# Altium project ELEC252_PowerSupply.PrjPcb
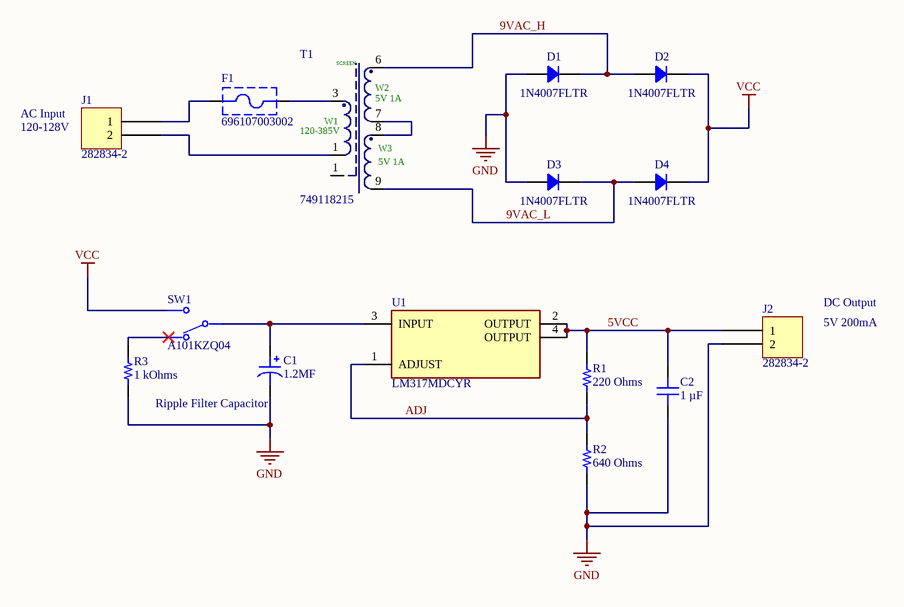
[diagram p0: TOP.SchDoc]
1 sheet, 15 parts. Net scope: global (net labels, ports and power ports of the same name join across sheets).

## Sheet TOP.SchDoc
size A; SheetNumber: 1; SheetTotal: 1

### Parts
C1  1.2MF  [CAP TH ALUM ELEC D18.00mm S7.50mm H21.50mm]
C2  1 µF  [CAP 0805_2012]
D1  1N4007FLTR  [SOD123F]
D2  1N4007FLTR  [SOD123F]
D3  1N4007FLTR  [SOD123F]
D4  1N4007FLTR  [SOD123F]
F1  696107003002  [696107003002]
J1  282834-2  [TE 282834-2]
J2  282834-2  [TE 282834-2]
R1  220 Ohms  [RES 0805_2012]
R2  640 Ohms  [RES 0805_2012]
R3  1 kOhms  [RES 0805_2012]
SW1  A101KZQ04  [FP-A101KZQ04-MFG]
T1  749118215  [EE16_8_5 (EF16)]
U1  LM317MDCYR  [FP-DCY0004A-MFG]

### Nets
GND: C1.2 C2.1 D1.1 D3.1 J2.2 R2.1 R3.2
VCC: D2.2 D4.2
5VCC: C2.2 J2.1 R1.2 U1.2(OUTPUT) U1.4(OUTPUT)
9VAC_H: D1.2 D2.1 T1.6
9VAC_L: D3.2 D4.1 T1.9
ADJ: R1.1 R2.2 U1.1(ADJUST)
NetC1_1: C1.1 U1.3(INPUT)
NetF1_1: F1.1 J1.1
NetF1_2: F1.2 T1.3
NetJ1_2: J1.2 T1.1
NetT1_7: T1.7 T1.8

Not connected (* = marked no-connect by the designer): R3 1*

### Notes on the sheet
- (near J1) AC Input
- (near J1) 120-128V
- DC Output
- 5V 200mA
- (near C1) Ripple Filter Capacitor
- (in symbol CMP-1476-00009-1) SCREEN; W2; 5V 1A; W1; 120-385V; W3

### Library data of the parts
C1 = EGQB350ELL122M20H: ALUMINUM CAPACITOR; manufacturer: United Chemi-Con; ESR (Equivalent Series Resistance): 84mOhm @ 100kHz; Lifetime @ Temp.: 1000 Hrs @ 150°C; Polarization: Polar; Ripple Current @ High Frequency: 3.25A @ 100kHz; Ripple Current @ Low Frequency: 1.95A @ 120Hz; Tolerance: ±20%; Voltage - Rated: 35V; Part Number: EGQB350ELL122M20H; Applications: Automotive; Capacitance: 1.2MF; componentlink1description: Datasheet; componentlink1url: http://www.chemi-con.co.jp/cgi-bin/CAT_DB/SEARCH/cat_db_al.cgi?e=e&j=p&pdfname=gqb; componentlink2description: DigiKey Link; componentlink2url: http://digikey.com/product-detail/en/united-chemi-con/EGQB350ELL122M20H/565-EGQB350ELL122M20H-ND/10486439; Device Package: Radial, Can; Height - Seated (Max): 0.846" (21.50mm); lastupdated: 9/2/2020 1:33:14 AM; Lead Spacing: 0.295" (7.50mm); Lifecycle Status: Active; Minimum Order: 1; Mounting Type: Through Hole; Operating Temperature: -40°C ~ 150°C; Package / Case: Radial, Can; packaging: Bulk; partid: 18006; Part Status: Active; price: 1.86; Ratings: AEC-Q200; series: GQB; Size / Dimension: 0.709" Dia (18.00mm); Supplier 1: DigiKey; Supplier Part Number 1: 565-EGQB350ELL122M20H-ND; value: 1.2MF
C2 = GMC21X5R105K50NT: CAP0805 X5R 1UF 10% 50V; manufacturer: Cal-Chip Electronics, Inc.; Part Number: GMC21X5R105K50NT; Value: 1 µF; Applications: General Purpose; Capacitance: 1 µF; componentlink1description: Datasheet; componentlink1url: https://88ce57.p3cdn1.secureserver.net/wp-content/uploads/2023/01/gmc_series-2.pdf; componentlink2description: DigiKey Link; componentlink2url: https://www.digikey.com/en/products/detail/cal-chip-electronics-inc/GMC21X5R105K50NT/19910722; Device Package: 0805 (2012 Metric); lastupdated: 2/4/2024 8:13:22 PM; Lifecycle Status: Active; Minimum Order: 1; Mounting Type: Surface Mount, MLCC; Operating Temperature: -55°C ~ 85°C; Package / Case: 0805 (2012 Metric); packaging: TapeAndReel; partid: 56638; price: 0.04; series: GMC; Size / Dimension: 0.079" L x 0.049" W (2.00mm x 1.25mm); Supplier 1: DigiKey; Supplier Part Number 1: 4713-GMC21X5R105K50NTCT-ND; Temperature Coefficient: X5R; Thickness (Max): 0.057" (1.45mm); Tolerance: ±10%; Voltage - Rated: 50V
D1-D4 = 1N4007FLTR: STANDARD RECTIFIER 1000V SOD-123; Manufacturer: SMC Diode Solutions; Capacitance @ Vr, F: 15pF @ 4V, 1MHz; Current - Average Rectified (Io): 1A; Current - Reverse Leakage @ Vr: 5µA @ 1000V; Speed: Standard Recovery >500ns, > 200mA (Io); Voltage - Forward (Vf) (Max) @ If: 1.1V @ 1A; Part Number: 1N4007FLTR; ComponentLink1Description: Datasheet; ComponentLink1URL: http://www.smc-diodes.com/propdf/1N4001FL-1N4007FL%20N1646%20REV.A.pdf; ComponentLink2Description: DigiKey Link; ComponentLink2URL: http://digikey.com/product-detail/en/smc-diode-solutions/1N4007FLTR/1655-1N4007FLCT-ND/11657827; Diode Type: Standard; LastUpdated: 8/30/2020 8:59:55 PM; Lifecycle Status: Active; Minimum Order: 1; Mounting Type: Surface Mount; Package / Case: SOD-123F; Packaging: TapeAndReel; PartId: 3314; Price: 0.01; Supplier 1: DigiKey; Supplier Part Number 1: 1655-1N4007FLCT-ND; Supplier Device Package: SOD-123FL; Voltage - DC Reverse (Vr) (Max): 1000V
F1 = CMP-1502-00236-2: NexarPartId: 56808806; Fuse Current: 10A; Voltage Rating (AC): 250V; Mount: Through Hole; RoHS: Non-Compliant; Packaging: Box; REACH SVHC: Unknown
J1 J2 = 282834-2: TERM BLK 2P SIDE ENT 2.54MM PCB; Manufacturer: TE Connectivity AMP Connectors; Current: 10A; Mating Orientation: Horizontal with Board; Number of Levels: 1; Pitch: 0.100" (2.54mm); Positions Per Level: 2; Voltage: 150V; Wire Gauge: 16-30 AWG; Wire Termination: Screw - Rising Cage Clamp; Part Number: 282834-2; Color: Green; ComponentLink1Description: Datasheet; ComponentLink1URL: https://www.te.com/commerce/DocumentDelivery/DDEController?Action=srchrtrv&DocNm=282834&DocType=Customer+Drawing&DocLang=English; ComponentLink2Description: DigiKey Link; ComponentLink2URL: http://digikey.com/product-detail/en/te-connectivity-amp-connectors/282834-2/A98333-ND/1150135; LastUpdated: 1/15/2020 4:15:38 AM; Lifecycle Status: Active; Minimum Order: 1; Mounting Type: Through Hole; Packaging: Bulk; Part Status: Active; Price: 0.88; Series: Buchanan; Supplier 1: DigiKey; Supplier Part Number 1: A98333-ND
R1 = ERJ-6GEYJ221V: RES SMD 220 OHM 5% 1/8W 0805; Manufacturer: Panasonic Electronic Components; Power (Watts): 0.125W, 1/8W; Temperature Coefficient: ±200ppm/°C; Part Number: ERJ-6GEYJ221V; Value: 220 Ohms; ComponentLink1Description: Datasheet; ComponentLink1URL: http://industrial.panasonic.com/www-cgi/jvcr13pz.cgi?E+PZ+3+AOA0001+ERJ6GEYJ221V+7+WW; ComponentLink2Description: DigiKey Link; ComponentLink2URL: https://www.digikey.com/en/products/detail/panasonic-electronic-components/ERJ-6GEYJ221V/89706; Composition: Thick Film; Device Package: 0805 (2012 Metric); Features: Automotive AEC-Q200; Height - Seated (Max): 0.028" (0.70mm); LastUpdated: 2/4/2024 9:05:03 PM; Lifecycle Status: Active; Minimum Order: 1; Number of Terminations: 2; Operating Temperature: -55°C ~ 155°C; Package / Case: 0805 (2012 Metric); Packaging: TapeAndReel; PartId: 30015; Part Status: Active; Price: 0.01; Ratings: AEC-Q200; Resistance: 220 Ohms; Series: ERJ-6G; Size / Dimension: 0.079" L x 0.049" W (2.00mm x 1.25mm); Supplier 1: DigiKey; Supplier Part Number 1: P220ACT-ND; Supplier Device Package: 0805; Tolerance: ±5%
R2 = APC0805B10K0N: CRCW0805640RFKTA; Manufacturer: Ohmite; Power (Watts): 0.1W, 1/10W; Resistance: 10 kOhms; Temperature Coefficient: ±25ppm/°C; Tolerance: ±0.1%; Part Number: APC0805B10K0N; Value: 640 Ohms; ComponentLink1Description: Datasheet; ComponentLink1URL: https://www.ohmite.com/assets/docs/APC-1-15.34.pdf; ComponentLink2Description: DigiKey Link; ComponentLink2URL: https://www.digikey.com/en/products/detail/ohmite/APC0805B10K0N/16369475; Composition: Thin Film; Device Package: 0805 (2012 Metric); Height - Seated (Max): 0.026" (0.65mm); LastUpdated: 2/4/2024 9:02:34 PM; Lifecycle Status: Active; Minimum Order: 1; Number of Terminations: 2; Operating Temperature: -55°C ~ 155°C; Package / Case: 0805 (2012 Metric); Packaging: TapeAndReel; PartId: 77972; Part Status: Active; Price: 0.05; Series: APC; Size / Dimension: 0.079" L x 0.049" W (2.00mm x 1.25mm); Supplier 1: DigiKey; Supplier Part Number 1: 273-APC0805B10K0NCT-ND; Supplier Device Package: 0805
R3 = 3430A2F1K0TDF: 3430 A2 1% 1K0 100PPM 1K RL; Manufacturer: TE Connectivity Passive Product; Power (Watts): 1W; Temperature Coefficient: ±100ppm/°C; Part Number: 3430A2F1K0TDF; Value: 1 kOhms; ComponentLink2Description: DigiKey Link; ComponentLink2URL: https://www.digikey.com/en/products/detail/te-connectivity-passive-product/3430A2F1K0TDF/17764297; Composition: Thick Film; Device Package: 0805 (2012 Metric); Features: Automotive AEC-Q200; Height - Seated (Max): 0.026" (0.65mm); LastUpdated: 2/4/2024 9:02:36 PM; Lifecycle Status: Active; Minimum Order: 1; Number of Terminations: 2; Operating Temperature: -55°C ~ 155°C; Package / Case: 0805 (2012 Metric); Packaging: TapeAndReel; PartId: 77520; Part Status: Active; Price: 0.02; Ratings: AEC-Q200; Resistance: 1 kOhms; Series: 3430; Size / Dimension: 0.049" L x 0.079" W (1.25mm x 2.00mm); Supplier 1: DigiKey; Supplier Part Number 1: 1712-3430A2F1K0TDFCT-ND; Supplier Device Package: 0508; Tolerance: ±1%
SW1 = CMP-03408-000009-1: SWITCH TOGGLE SPDT 5A 120V; Actuator Length: 16.51mm; Contact Resistance: 10mR; Max Voltage Rating (AC): 250V; Max Voltage Rating (DC): 28V; Actuator Material: Brass; Actuator Color: Chrome; Illumination Type: Non-Illuminated; Switch Function: On-On; Electrical Life: 6000Cycles; Actuator Type: LOCKING LEVER; Flammability Rating: UL94 V-1; Series: Gemini A; Package Quantity: 500; Current Rating: 5A; Voltage Rating (AC): 120V; Lead Free: Lead Free; Min Operating Temperature: -20°C; Orientation: Straight; Contact Current Rating: 5A; Max Operating Temperature: 85°C; Case/Package: 125; ELV: Compliant; Contact Material: Copper; Throw Configuration: SPDT; Packaging: Bulk; Voltage Rating (DC): 28V; Mount: Panel; Termination: Lug; Contact Plating: Silver
T1 = CMP-1476-00009-1: Off-Line Transformer WE-UNIT , L=0.9mH; Manufacturer: Wuerth Elektronik; Turns Ratio: "19","1:1"; Input Voltage (AC): 85-265; Output Voltage (DC): 5; Output Current (A): 0.6; Inductance: 0.9mH; ComponentLink1URL: http://www.we-online.com; PartNumber: 749118215; PackageReference: EE16_8_5 (EF16); ComponentLink1Description: Manufacturer URL; ComponentLink2Description: Datasheet; ComponentLink2URL: http://www.we-online.de/katalog/media/pdf/749118215.pdf
U1 = CMP-04917-000052-1: IC REG LIN POS ADJ 500MA SOT223; Manufacturer: Texas Instruments; Output Type: AdjustableProgrammable; Output Voltage: 1.25-37V; Standoff Height: 0.02mm; Max Junction Temp: +125°C; Min Supply Voltage: 2.5V; Number Of Outputs: 1; Output Current: 0.5A; Max Supply Voltage: 40V; Lead Free: Yes; Digikey Description: IC REG LIN POS ADJ 500MA SOT223; Temperature Range Low: -40°C; Height: 1.8mm; RoHS: TRUE; Octopart: https://octopart.com/lm317mdcyr-texas+instruments-525261; Device Class L2: Power Management ICs; ComponentLink2Description: Datasheet; Device Class L1: Integrated Circuits (ICs); Ipc Land Pattern Name: SOT230P700X180-4; Manufacturer Part Number: LM317MDCYR; Mouser Description: Linear Voltage Regulators 3-Term Adj. Pos.; Automotive: No; Device Class L3: Voltage Regulators - Linear; Temperature Range High: +125°C; Temperature: -40°C to +125°C; ComponentLink2URL: http://www.ti.com/general/docs/suppproductinfo.tsp?distId=10&gotoUrl=http%3A%2F%2Fwww.ti.com%2Flit%2Fgpn%2Flm317m; Package: DCY0004A; Category: IC